# EAGLE design Dover Driver (EAGLE 9.6.2)
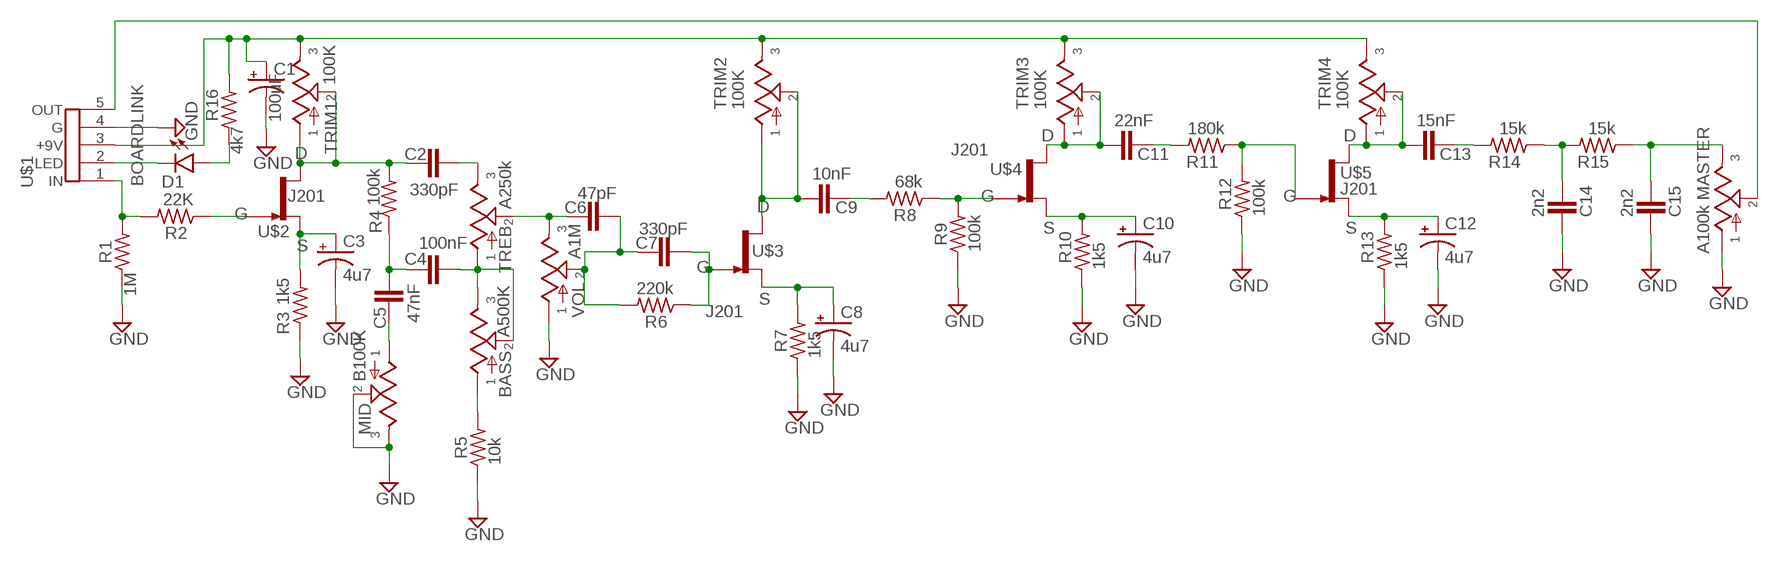
[diagram p0: schematic, sheet 1]

## Parts
BASS  A500K  POT16MM  [16MM]
C1  100uF  0631  [063_025]
C2  330pF  050X030_0251  [050X030_025]
C3  4u7  0501  [050_020_1]
C4  100nF  075X0402  [075X040]
C5  47nF  072X0252  [072X025]
C6  47pF  050X030_0251  [050X030_025]
C7  330pF  050X030_0251  [050X030_025]
C8  4u7  0501  [050_020_1]
C9  10nF  072X0252  [072X025]
C10  4u7  0501  [050_020_1]
C11  22nF  072X0252  [072X025]
C12  4u7  0501  [050_020_1]
C13  15nF  072X0252  [072X025]
C14  2n2  072X0252  [072X025]
C15  2n2  072X0252  [072X025]
D1  LED3MM  [LED3MM]
MASTER  A100k  POT16MM  [16MM]
MID  B100K  POT16MM  [16MM]
R1  1M  6MM.3  [R0207/3]
R2  22K  6MM.3  [R0207/3]
R3  1k5  6MM.3  [R0207/3]
R4  100k  6MM.3  [R0207/3]
R5  10k  6MM.3  [R0207/3]
R6  220k  6MM.3  [R0207/3]
R7  1k5  6MM.3  [R0207/3]
R8  68k  6MM.3  [R0207/3]
R9  100k  6MM.3  [R0207/3]
R10  1k5  6MM.3  [R0207/3]
R11  180k  6MM.3  [R0207/3]
R12  100k  6MM.3  [R0207/3]
R13  1k5  6MM.3  [R0207/3]
R14  15k  6MM.3  [R0207/3]
R15  15k  6MM.3  [R0207/3]
R16  4k7  6MM.3  [R0207/3]
TREB  A250k  POT16MM  [16MM]
TRIM1  100K  POTTRIM  [ROUNDTRIM]
TRIM2  100K  POTTRIM  [ROUNDTRIM]
TRIM3  100K  POTTRIM  [ROUNDTRIM]
TRIM4  100K  POTTRIM  [ROUNDTRIM]
U$1  BOARDLINK  [BOARDLINK]
U$2  J201  MMBF5458  [SOT23]
U$3  J201  MMBF5458  [SOT23]
U$4  J201  MMBF5458  [SOT23]
U$5  J201  MMBF5458  [SOT23]
VOL  A1M  POT16MM  [16MM]

## Nets
GND: C1.- C3.- C8.- C10.- C12.- C14.2 C15.2 MASTER.1 MID.2 MID.3 R1.1 R3.1 R5.1 R7.1 R9.1 R10.1 R12.1 R13.1 U$1.4(G) VOL.1
N$1: R1.2 R2.2 U$1.1(IN)
N$2: R2.1 U$2.3(G)
N$3: C3.+ R3.2 U$2.2(S)
N$4: C2.1 R4.2 TRIM1.1 TRIM1.2 U$2.1(D)
N$5: C1.+ R16.2 TRIM1.3 TRIM2.3 TRIM3.3 TRIM4.3 U$1.3(+9V)
N$6: C2.2 TREB.3
N$7: C4.1 C5.2 R4.1
N$8: C5.1 MID.1
N$9: BASS.2 BASS.3 C4.2 TREB.1
N$10: BASS.1 R5.2
N$11: C6.1 TREB.2 VOL.3
N$12: C6.2 C7.1 R6.2 VOL.2
N$13: C7.2 R6.1 U$3.3(G)
N$14: C8.+ R7.2 U$3.2(S)
N$15: C9.2 TRIM2.1 TRIM2.2 U$3.1(D)
N$16: C9.1 R8.2
N$17: R8.1 R9.2 U$4.3(G)
N$18: C11.2 TRIM3.1 TRIM3.2 U$4.1(D)
N$19: C10.+ R10.2 U$4.2(S)
N$20: C11.1 R11.2
N$21: R11.1 R12.2 U$5.3(G)
N$22: C12.+ R13.2 U$5.2(S)
N$23: C13.2 TRIM4.1 TRIM4.2 U$5.1(D)
N$24: C15.1 MASTER.3 R15.1
N$25: C14.1 R14.1 R15.2
N$26: C13.1 R14.2
N$27: MASTER.2 U$1.5(OUT)
N$28: D1.A R16.1
N$29: D1.K(C) U$1.2(LED)

## Library data of the parts
BASS MASTER MID TREB VOL = mb_pots:POT: Potentiometers the arrow indicates the clockwise motion of th wiper (lug 2) fully counter clockwise there is no resistance between lugs 1 and 2 fully clockwise the resistance between lugs 1 and 2 is the value of the pot
C1 = mb_caps-electro:063: 33 - 220uF Xicon values at Mouser.com 10V: 220uF; 16V: 100uF; 25V: 100uF; 50V: 33uF
C2 C6 C7 = mb_caps-ceramic:050X030_025: 47 - 120pF Xicon Ceramic Disc 2.5mm lead spacing
C3 C8 C10 C12 = mb_caps-electro:050: 0.22 - 100uF Xicon values at Mouser.com: 10V: 10 - 100uF; 16V: 2.2 - 47uF; 25V: 0.47 - 47uF; 50V: 0.22 - 22uF
C4 = mb_caps-chicklet:075X040: 0.039 - 0.047uF Panasonic ECQ-B 7mm x 4mm 50V: 0.039 - 0.047uF;
C5 C9 C11 C13-C15 = mb_caps-box:072X025: 1000pF - 0.47uF WIMA MKP2 63, 100V: 1000pF - 0.015uF; MKS2 50V: 0.33 - 0.47uF; 63V: 1000pF - 0.22uF;
D1 = mb_diodes:LED
R1-R16 = mb_resistors:6MM: 6mm Resistors Leads spaced 1-6 holes apart for 0.1" perfboard. Suitable for 1/4 watt resistors.
TRIM1-TRIM4 = xc_library:POT: Potentiometers the arrow indicates the clockwise motion of th wiper (lug 2) fully counter clockwise there is no resistance between lugs 1 and 2 fully clockwise the resistance between lugs 1 and 2 is the value of the pot
U$1 = xc_library:BOARDLINK
U$2-U$5 = xc_library:MMBF5458: SMD 5458

## Board
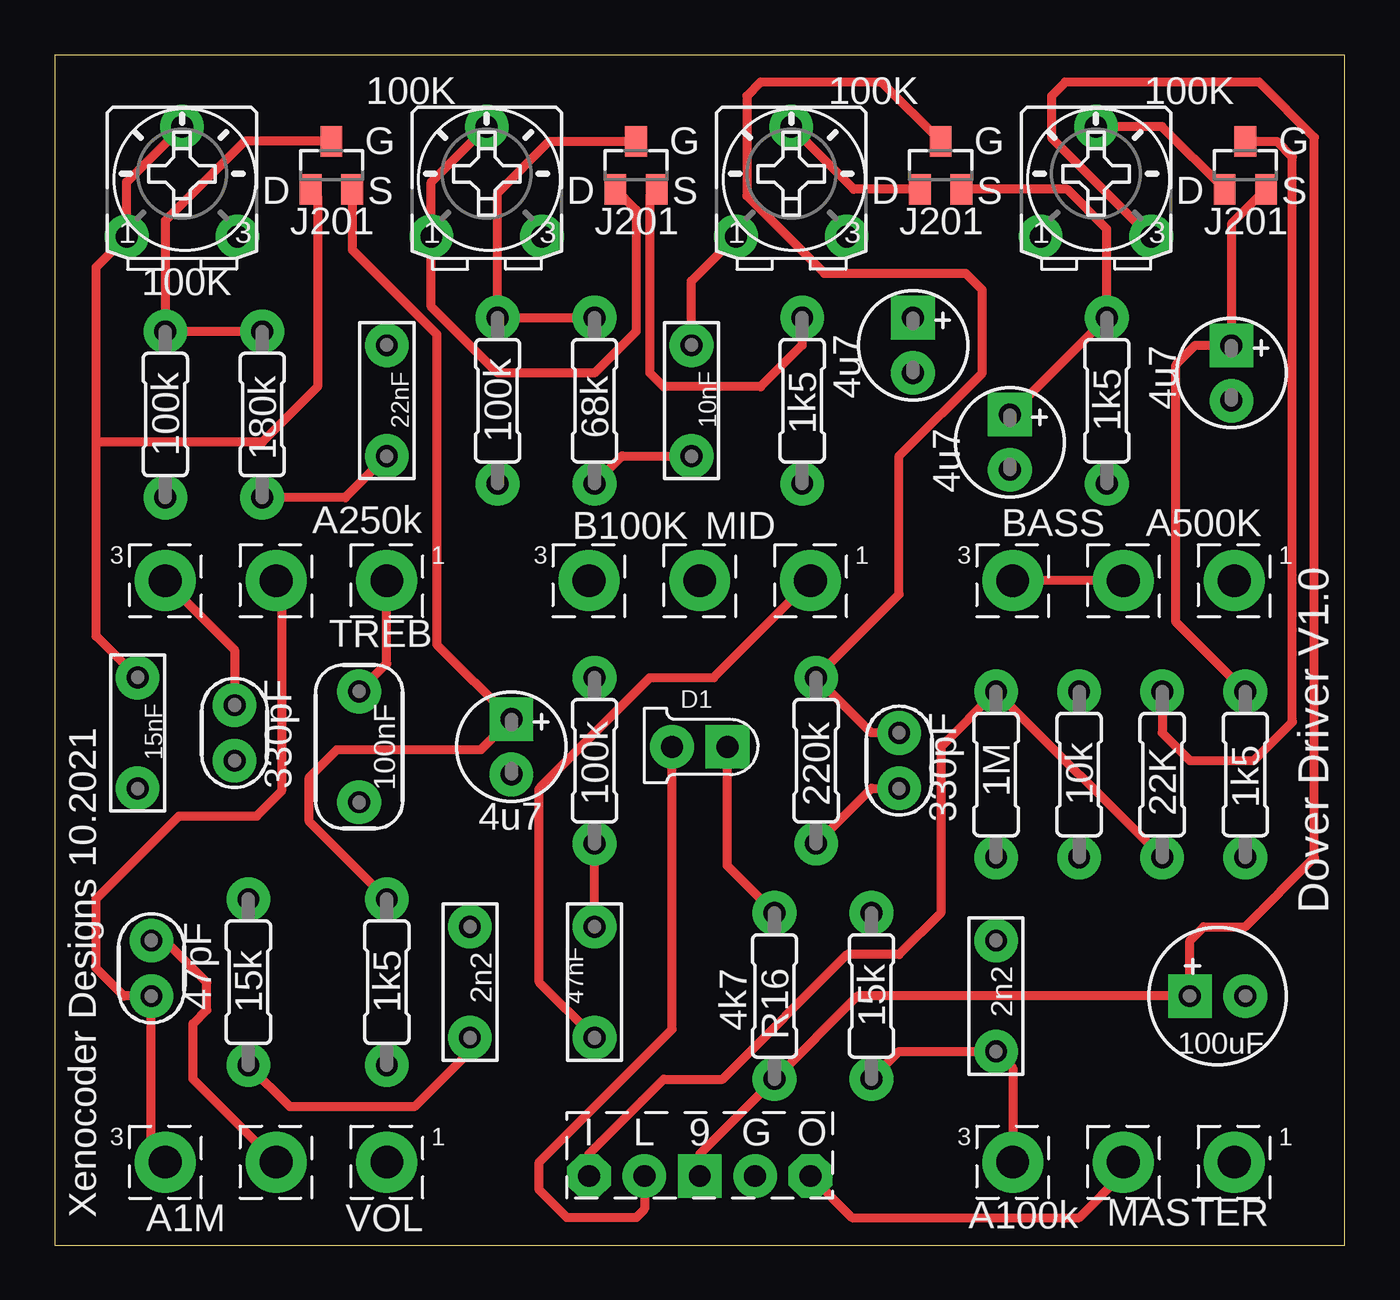
[diagram p1: board, top side]
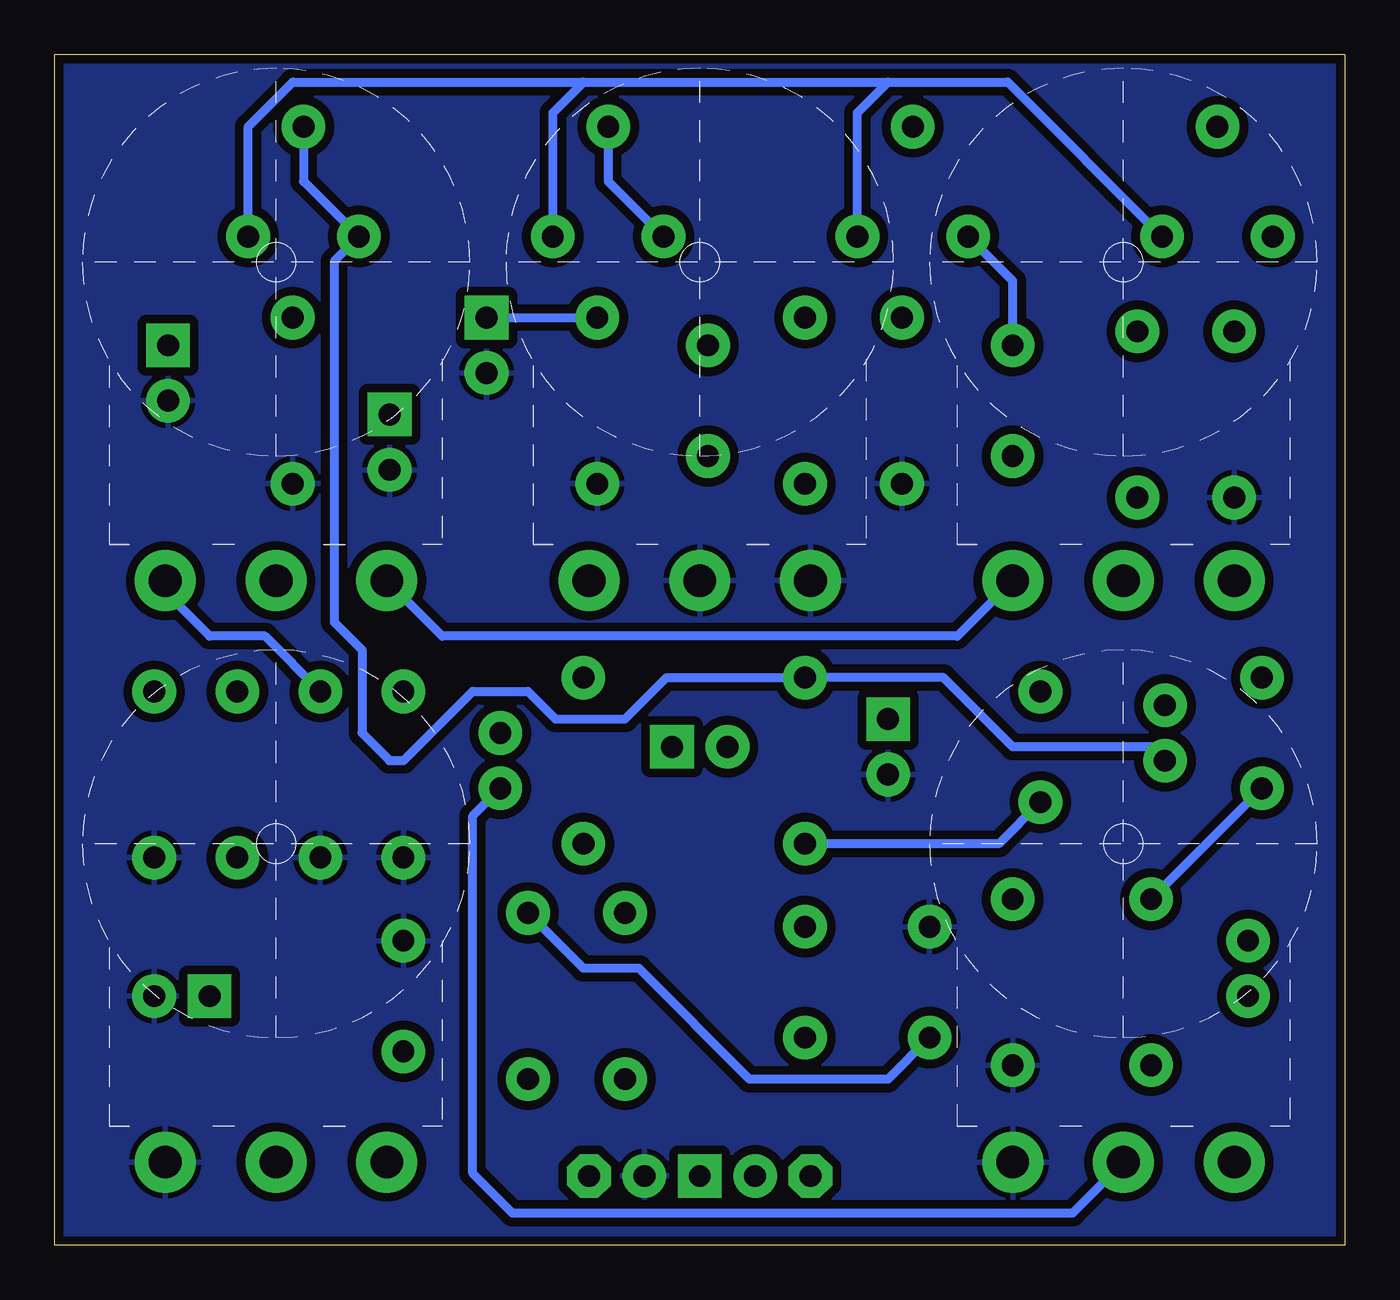
[diagram p2: board, bottom side, seen from below]

Size 59.18 x 54.61 mm. Coordinates in mm from the lower left corner, seen from the top.
Outline: 0,0 59.18,0 59.18,54.61 0,54.61 0,0
Copper layers (1*16): Top 0.035559375mm / dielectric 1.6mm / Bottom 0.035559375mm
Design rules "oshpark-2layer": minimum track width 6mil, minimum drill 10mil, track to track 6mil, track to pad 6mil, pad to pad 6mil, via to via 6mil, smd to smd 6mil, copper to edge 15mil, drill to drill 6mil, minimum pad ring 5mil, minimum via ring 5mil, stop-mask expansion 2.5mil, vias tented up to drill 0mil, thermal gap 10mil

### Footprints (pad centres in the part's own frame; a part is rotated, then mirrored left to right if it is on the bottom)
16MM = drill 1.5 pad 2.794: 1 5.08,0; 2 0,0; 3 -5.08,0
063_025 = drill 1 pad 2 square: + -1.27,0 | drill 1 pad 2: - 1.27,0
050X030_025 = drill 1 pad 2: 1 -1.27,0; 2 1.27,0
050_020_1 = drill 1 pad 2 square: + -1.27,0 | drill 1 pad 2: - 1.27,0
075X040 = drill 1 pad 2: 1 -2.54,0; 2 2.54,0
072X025 = drill 1 pad 2: 1 -2.54,0; 2 2.54,0
LED3MM = drill 1 pad 2 square: A -1.27,0 | drill 1 pad 2: K 1.27,0
R0207/3 = drill 1 pad 2: 1 -3.81,0; 2 3.81,0
ROUNDTRIM = drill 1 pad 2: 1 -3.04,-2; 2 -0.5,3.04; 3 2.04,-2
BOARDLINK = drill 1 pad 2 octagon: 1 -2.54,0; 5 7.62,0 | drill 1 pad 2: 2 0,0; 4 5.08,0 | drill 1 pad 2 square: 3 2.54,0
SOT23 = smd 1 x 1.4: 1 -0.95,-1.1; 2 0.95,-1.1; 3 0,1.1

### Placement (x,y rotation side)
BASS  49.02,30.48 0 top
C1  53.34,11.43 0 top
C2  8.26,23.5 90 top
C3  53.98,40.01 270 top
C4  13.97,22.86 90 top
C5  24.77,12.06 90 top
C6  4.45,12.7 90 top
C7  38.73,22.23 90 top
C8  43.81,36.83 270 top
C9  29.21,38.73 90 top
C10  39.37,41.27 270 top
C11  15.24,38.73 90 top
C12  20.95,22.86 270 top
C13  3.81,23.5 90 top
C14  19.05,12.06 90 top
C15  43.18,11.43 90 top
D1  29.59,22.86 180 top
MASTER  49.02,3.81 0 top
MID  29.59,30.48 0 top
R1  43.18,21.59 90 top
R2  50.8,21.59 270 top
R3  54.61,21.59 90 top
R4  24.77,22.23 90 top
R5  46.99,21.59 90 top
R6  34.92,22.23 270 top
R7  48.26,38.73 90 top
R8  24.77,38.73 270 top
R9  20.32,38.73 90 top
R10  34.29,38.73 90 top
R11  9.53,38.1 270 top
R12  5.08,38.1 90 top
R13  15.24,12.06 90 top
R14  8.89,12.06 90 top
R15  37.47,11.43 90 top
R16  33.02,11.43 270 top
TREB  10.16,30.48 0 top
TRIM1  48.26,48.26 0 top
TRIM2  34.29,48.26 0 top
TRIM3  20.32,48.26 0 top
TRIM4  6.35,48.26 0 top
U$1  27.05,3.17 0 top
U$2  54.61,49.53 0 top
U$3  40.64,49.53 0 top
U$4  26.67,49.53 0 top
U$5  12.7,49.53 0 top
VOL  10.16,3.81 0 top

### Tracks (layer width: path | path; a pad name or v marks a point on that pad's centre or on a via)
GND
  pour Bottom (isolate 0.406): 0,0 0,54.61 59.18,54.61 59.18,0
N$1
  Top 0.406: U$1.1 24.51,4.19 27.94,7.62 30.64,7.62 36.35,13.34 38.73,13.34 40.64,15.24 40.64,22.86 R1.2 R2.2
N$2
  Top 0.406: U$2.3 56.05,50.63 56.77,49.91 56.77,24 54.99,22.23 52.07,22.23 50.8,23.5 R2.1
N$3
  Top 0.406: U$2.2 53.98,46.84 C3.+ 52.32,41.27 51.44,40.39 51.44,28.57 R3.2
N$4
  Top 0.406: U$2.1 50.79,51.3 TRIM1.2
  Bottom 0.406: C2.1 8.89,22.86 15.24,22.86 18.41,26.04 R4.2 31.11,26.04 33.02,24.13 36.2,24.13 37.47,25.4 40.01,25.4 43.18,22.23 43.81,22.23 45.09,23.5 45.09,27.3 46.35,28.57 46.35,45.12 TRIM1.1 47.76,48.8 TRIM1.2
N$5
  Top 0.406: U$1.3 29.59,4.19 R16.2 36.83,11.43 C1.+ 52.07,13.97 52.7,14.61 54.61,14.61 57.78,17.78 57.78,50.8 55.24,53.34 46.35,53.34 45.72,52.7 45.72,50.8 50.26,46.26 TRIM1.3
  Bottom 0.406: TRIM4.3 15.47,53.34 20.95,53.34 | TRIM3.3 22.36,51.94 20.95,53.34 | TRIM2.3 36.33,51.94 34.92,53.34 | 34.92,53.34 20.95,53.34 | TRIM1.3 50.3,51.3 48.26,53.34 34.92,53.34
N$6
  Top 0.406: TREB.3 8.26,27.3 C2.2
N$7
  Top 0.406: C5.2 R4.1
  Bottom 0.406: C4.1 15.88,18.41 R4.1
N$8
  Top 0.406: MID.1 30.23,26.04 27.3,26.04 22.31,21.04 22.31,21.03 22.23,20.94 22.23,12.06 C5.1
N$9
  Top 0.406: C4.2 15.24,26.67 TREB.1 | BASS.2 BASS.3
  Bottom 0.406: TREB.1 17.78,27.94 41.4,27.94 BASS.3
N$10
  Bottom 0.406: R5.2 49.53,27.94 52.07,27.94 54.1,29.97 BASS.1
N$11
  Top 0.406: VOL.3 4.45,4.45 C6.1 3.17,11.43 1.91,12.7 1.91,15.88 5.71,19.68 9.27,19.68 10.41,20.83 10.41,30.23 TREB.2
N$12
  Top 0.406: VOL.2 6.35,7.62 6.35,10.16 6.99,10.79 6.99,12.06 5.08,13.97 C6.2 | R6.2 37.47,20.95 C7.1
  Bottom 0.406: VOL.2 12.5,1.47 38.18,1.47 40.01,3.3 40.01,19.68 C7.1
N$13
  Top 0.406: C7.2 37.47,23.5 R6.1 38.73,29.84 38.73,36.2 42.55,40.01 42.55,43.81 41.78,44.58 35.31,44.58 31.75,48.13 31.75,52.7 32.38,53.34 37.93,53.34 U$3.3
N$14
  Top 0.406: U$3.2 46.44,48.43 48.26,46.61 R7.2 C8.+
N$15
  Top 0.406: C9.2 29.21,44.22 TRIM2.1 | U$3.1 36.66,48.43 TRIM2.2
  Bottom 0.406: TRIM2.2 33.79,48.8 TRIM2.1
N$16
  Top 0.406: R8.2 26.04,36.2 C9.1
N$17
  Top 0.406: R8.1 R9.2 20.32,48.26 22.69,50.63 U$4.3
N$18
  Top 0.406: TRIM3.2 17.28,48.76 TRIM3.1 17.28,43.05 20.32,40.01 24.77,40.01 26.67,41.91 26.67,47.48 U$4.1
  Bottom 0.406: C11.2 15.24,44.22 TRIM3.1
N$19
  Top 0.406: R10.2 34.29,41.27 32.38,39.37 27.94,39.37 27.3,40.01 27.3,48.12 U$4.2
  Bottom 0.406: C10.+ R10.2
N$20
  Top 0.406: C11.1 13.34,34.29 R11.2
N$21
  Top 0.406: R11.1 R12.2 5.08,46.99 8.72,50.63 U$5.3
N$22
  Top 0.406: R13.2 11.68,19.43 11.68,21.46 12.95,22.73 19.56,22.73 C12.+ 17.53,27.56 17.53,41.78 13.65,45.66 U$5.2
N$23
  Top 0.406: TRIM4.2 3.31,48.76 TRIM4.1 1.91,44.85 1.91,36.83 | C13.2 1.91,27.94 1.91,36.83 | U$5.1 12.06,48.12 12.06,39.37 9.53,36.83 1.91,36.83
N$24
  Top 0.406: R15.1 38.73,8.89 C15.1 43.94,8.13 MASTER.3
N$25
  Top 0.406: R14.1 10.79,6.35 16.51,6.35 19.05,8.89 C14.1
  Bottom 0.406: C14.1 20.95,7.62 27.3,7.62 32.38,12.7 34.92,12.7 R15.2
N$26
  Bottom 0.406: R14.2 C13.1
N$27
  Top 0.406: U$1.5 36.58,1.27 46.99,1.27 49.02,3.3 MASTER.2
N$28
  Top 0.406: R16.1 30.86,17.4 D1.A
N$29
  Top 0.406: U$1.2 27.05,1.65 26.67,1.27 23.5,1.27 22.23,2.54 22.23,3.81 28.32,9.91 D1.K

### Text on the board
tNames: Dover Driver V1.0 | Xenocoder Designs 10.2021